# EAGLE schematic Cat_Ears (EAGLE 6.4)
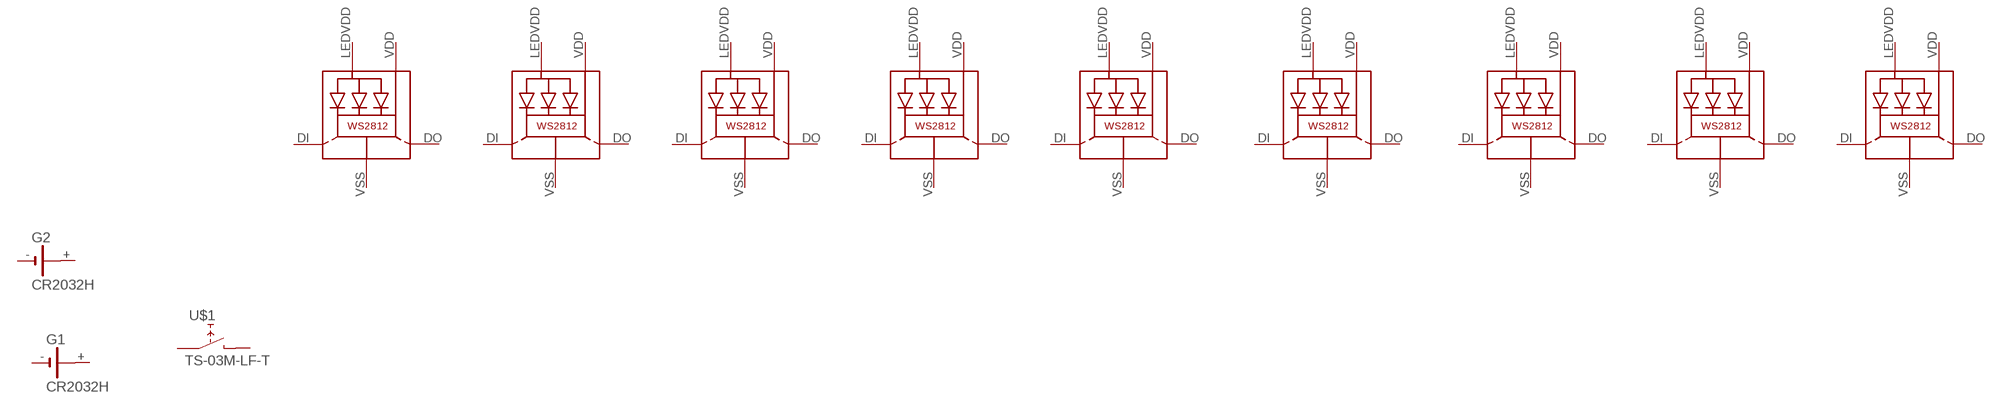
[diagram p0: schematic, sheet 1]

## Parts
G1  CR2032H  [CR2032H]
G2  CR2032H  [CR2032H]
LED9  WS2812  [WS2812]
LED10  WS2812  [WS2812]
LED11  WS2812  [WS2812]
LED12  WS2812  [WS2812]
LED13  WS2812  [WS2812]
LED14  WS2812  [WS2812]
LED15  WS2812  [WS2812]
LED16  WS2812  [WS2812]
LED17  WS2812  [WS2812]
U$1  TS-03M-LF-T  [TS-03M-LF-T]
Unconnected: G1.+ G1.+@1(+) G1.- G2.+ G2.+@1(+) G2.- LED9.DI LED9.DO LED10.DI LED10.DO LED11.DI LED11.DO LED12.DI LED12.DO LED13.DI LED13.DO LED14.DI LED14.DO LED15.DI LED15.DO LED16.DI LED16.DO LED17.DI LED17.DO U$1.P$1(A1) U$1.P$2(B)

## Power pins joined to a net without a drawn wire
GND: LED9.VSS(GND) LED10.VSS(GND) LED11.VSS(GND) LED12.VSS(GND) LED13.VSS(GND) LED14.VSS(GND) LED15.VSS(GND) LED16.VSS(GND) LED17.VSS(GND)
LEDVDD: LED9.LEDVDD LED10.LEDVDD LED11.LEDVDD LED12.LEDVDD LED13.LEDVDD LED14.LEDVDD LED15.LEDVDD LED16.LEDVDD LED17.LEDVDD
VDD: LED9.VDD LED10.VDD LED11.VDD LED12.VDD LED13.VDD LED14.VDD LED15.VDD LED16.VDD LED17.VDD

## Library data of the parts
G1 G2 = battery:CR2032H: LI BATTERY Varta
LED9-LED17 = adafruit:WS2812
U$1 = RobThePyro:TS-03M-LF-T